# EAGLE design hermes_prog (EAGLE 8.3.0)
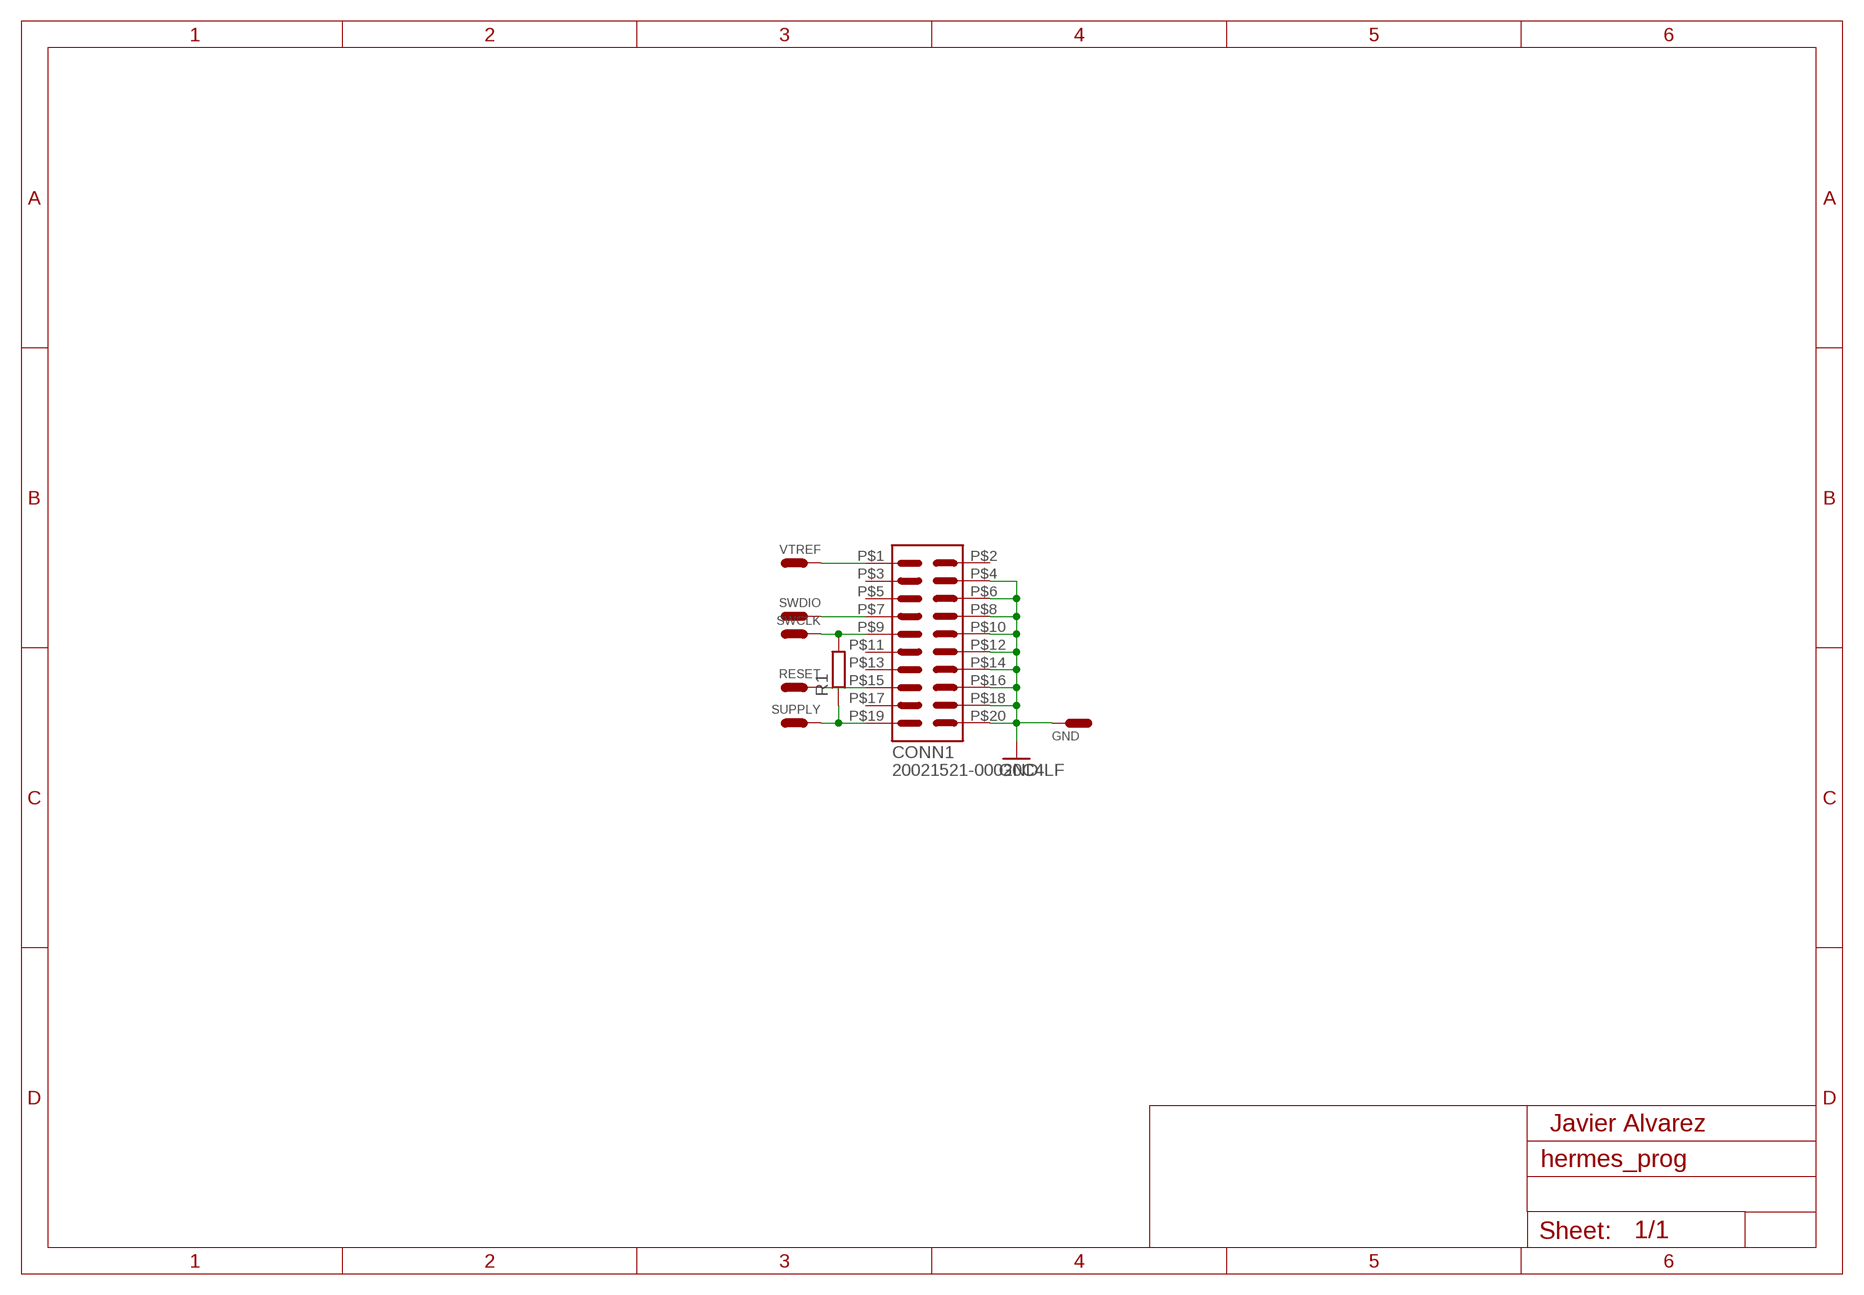
[diagram p0: schematic, sheet 1]

## Parts
CONN1  20021521-00020C4LF  [JTAG-20]
GND  S7231-45R  [SPRING-CONTACT]
R1  R-EU_0204/2V  [0204V]
RESET  S7231-45R  [SPRING-CONTACT]
SUPPLY  S7231-45R  [SPRING-CONTACT]
SWCLK  S7231-45R  [SPRING-CONTACT]
SWDIO  S7231-45R  [SPRING-CONTACT]
VTREF  S7231-45R  [SPRING-CONTACT]

## Nets
GND: CONN1.P$4 CONN1.P$6 CONN1.P$8 CONN1.P$10 CONN1.P$12 CONN1.P$14 CONN1.P$16 CONN1.P$18 CONN1.P$20 GND.P$1 GND.P$2
RESET: CONN1.P$15 RESET.P$1 RESET.P$2
SUPPLY: CONN1.P$19 R1.1 SUPPLY.P$1 SUPPLY.P$2
SWCLK: CONN1.P$9 R1.2 SWCLK.P$1 SWCLK.P$2
SWDIO: CONN1.P$7 SWDIO.P$1 SWDIO.P$2
VTREF: CONN1.P$1 VTREF.P$1 VTREF.P$2
Unconnected: CONN1.P$2 CONN1.P$3 CONN1.P$5 CONN1.P$11 CONN1.P$13 CONN1.P$17

## Notes on the sheet
- Javier Alvarez

## Library data of the parts
CONN1 = Hermes_lib:20021521-00020C4LF
GND RESET SUPPLY SWCLK SWDIO VTREF = Hermes_lib:S7231-45R
R1 = resistor:R-EU_: RESISTOR, European symbol

## Board
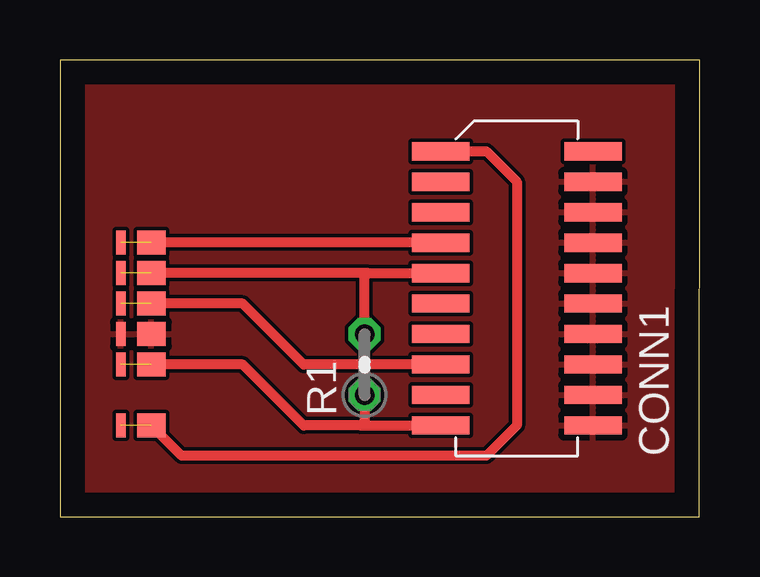
[diagram p1: board, top side]

Size 26.67 x 19.05 mm. Coordinates in mm from the lower left corner, seen from the top.
Outline: 0,0 26.65,0 26.67,19.05 0,19.05 0,0
Copper layers (1*16): Top 0.035mm / dielectric 1.5mm / Bottom 0.035mm
Design rules "default": minimum track width 6mil, minimum drill 0.35mm, track to track 6mil, track to pad 6mil, pad to pad 6mil, via to via 6mil, smd to smd 6mil, copper to edge 40mil, drill to drill 6mil, minimum pad ring 10mil, minimum via ring 8mil, stop-mask expansion 4mil, vias tented up to drill 0mil, thermal gap 10mil

### Footprints (pad centres in the part's own frame; a part is rotated, then mirrored left to right if it is on the bottom)
JTAG-20 = smd 2.388 x 0.762: P$1 -3.175,5.08; P$2 3.175,5.08; P$3 -3.175,3.81; P$4 3.175,3.81; P$5 -3.175,2.54; P$6 3.175,2.54; P$7 -3.175,1.27; P$8 3.175,1.27; P$9 -3.175,0; P$10 3.175,0; P$11 -3.175,-1.27; P$12 3.175,-1.27; P$13 -3.175,-2.54; P$14 3.175,-2.54; P$15 -3.175,-3.81; P$16 3.175,-3.81; P$17 -3.175,-5.08; P$18 3.175,-5.08; P$19 -3.175,-6.35; P$20 3.175,-6.35
SPRING-CONTACT = smd 1.2 x 1: P$1 0,0 | smd 0.4 x 1: P$2 -1.27,0
0204V = drill 0.813 octagon: 1 -1.27,0; 2 1.27,0

### Placement (x,y rotation side)
CONN1  19.05,10.16 0 top
GND  3.81,7.62 0 top
R1  12.7,6.35 90 top
RESET  3.81,8.89 0 top
SUPPLY  3.81,6.35 0 top
SWCLK  3.81,10.16 0 top
SWDIO  3.81,11.43 0 top
VTREF  3.81,3.81 0 top

### Tracks (layer width: path | path; a pad name or v marks a point on that pad's centre or on a via)
GND
  pour Top: 0,19.05 0,0 26.67,0 26.67,19.05
RESET  (1 unrouted)
  Top 0.406: CONN1.P$15 10.16,6.35 7.62,8.89 RESET.P$1
SUPPLY  (1 unrouted)
  Top 0.406: 12.54,3.81 CONN1.P$19 | 12.54,3.81 10.16,3.81 7.62,6.35 SUPPLY.P$1 | R1.1 12.7,3.98 12.54,3.81
SWCLK  (1 unrouted)
  Top 0.406: 12.87,10.16 CONN1.P$9 | 12.87,10.16 SWCLK.P$1 | R1.2 12.7,9.99 12.87,10.16
SWDIO  (1 unrouted)
  Top 0.406: CONN1.P$7 SWDIO.P$1
VTREF  (1 unrouted)
  Top 0.406: CONN1.P$1 17.78,15.24 19.05,13.97 19.05,3.81 17.78,2.54 5.08,2.54 VTREF.P$1